# Altium schematic sheet schema_Project.SchDoc
size A4
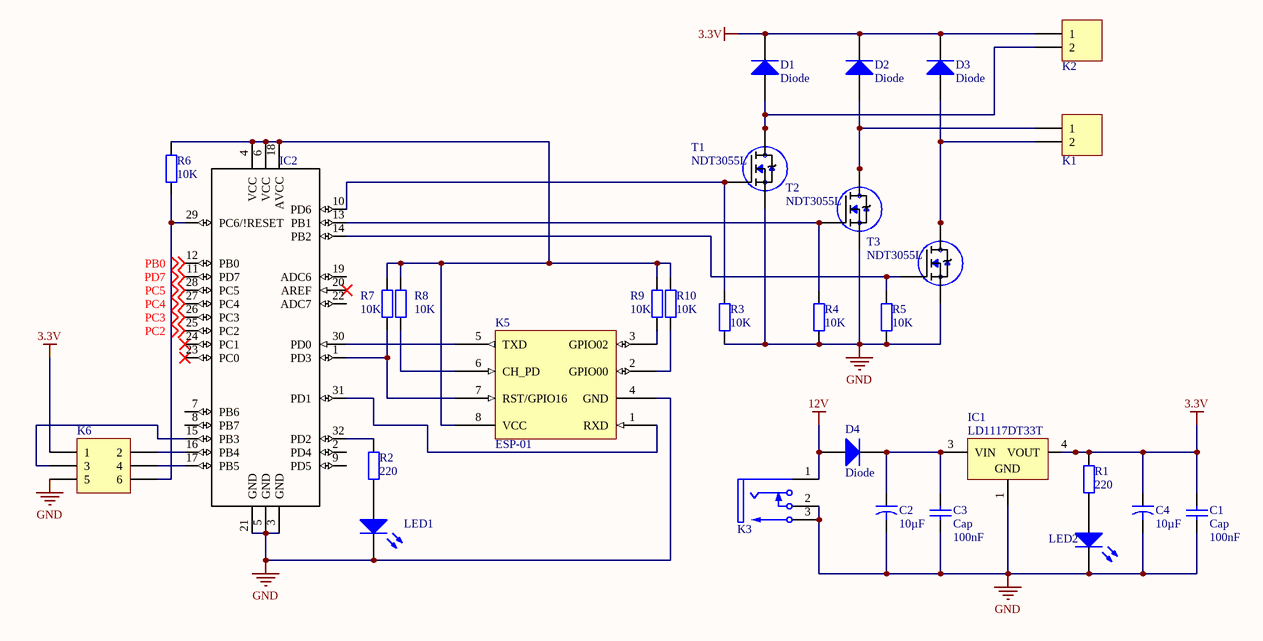
[diagram p0: schema_Project.SchDoc]

## Parts
C1  Cap  value 100nF  [C13+R]
C2  value 10µF  [C24]  (hidden comment: Cap2)
C3  Cap  value 100nF  [C13+R]
C4  value 10µF  [C24]  (hidden comment: Cap2)
D1  Diode  [Diode]
D2  Diode  [Diode]
D3  Diode  [Diode]
D4  Diode  [Diode]
ESP-01  K5  [HDR2X4]
IC1  LD1117DT33T  [TO-252_N]
IC2  ATMEGA328P-AU  [*QFP80P900X900X120-32N]  (value not drawn)
K1  K1  [K12]
K2  K2  [K12]
K3  K3  [SWITCH-RAPC712X-3_V]
K6  Header 3X2  [HDR2X3]  (value not drawn)
LED1  LED1  [LED]  (value not drawn)
LED2  LED2  [LED]  (value not drawn)
R1  value 220  [C13+R]  (hidden comment: Res2)
R2  value 220  [C13+R]  (hidden comment: Res2)
R3  value 10K  [C13+R]  (hidden comment: Res2)
R4  value 10K  [C13+R]  (hidden comment: Res2)
R5  value 10K  [C13+R]  (hidden comment: Res2)
R6  value 10K  [C13+R]  (hidden comment: Res2)
R7  value 10K  [C13+R]  (hidden comment: Res2)
R8  value 10K  [C13+R]  (hidden comment: Res2)
R9  value 10K  [C13+R]  (hidden comment: Res2)
R10  value 10K  [C13+R]  (hidden comment: Res2)
T1  NDT3055L  [*SOT223-4]
T2  NDT3055L  [*SOT223-4]
T3  NDT3055L  [*SOT223-4]

## Nets
3.3V: C1.2 C4.1 D1.K D2.K D3.K IC1.4(VOUT) K2.1 K6.1 R1.2
12V: D4.A K3.1
GND: C1.1 C2.2 C3.1 C4.2 ESP-01.4(GND) IC1.1(GND) IC2.3(GND) IC2.5(GND) IC2.21(GND) K3.2 K3.3 K6.5 LED1.K LED2.K R3.2 R4.1 R5.1 T1.3(S) T2.3(S) T3.3(S)
PB0: IC2.12(PB0) ; off-sheet PB0
PC2: IC2.25(PC2) ; off-sheet PC2
PC3: IC2.26(PC3) ; off-sheet PC3
PC4: IC2.27(PC4) ; off-sheet PC4
PC5: IC2.28(PC5) ; off-sheet PC5
PD7: IC2.11(PD7) ; off-sheet PD7
NetC2_1: C2.1 C3.2 D4.K IC1.3(VIN)
NetD1_A: D1.A K2.2 T1.2(D) T1.4(D)
NetD2_A: D2.A K1.1 T2.2(D) T2.4(D)
NetD3_A: D3.A K1.2 T3.2(D) T3.4(D)
NetESP-01_1: ESP-01.1(RXD) IC2.31(PD1)
NetESP-01_2: ESP-01.2(GPIO00) R10.1
NetESP-01_3: ESP-01.3(GPIO02) R9.1
NetESP-01_5: ESP-01.5(TXD) IC2.30(PD0)
NetESP-01_6: ESP-01.6(CH_PD) R8.1
NetESP-01_7: ESP-01.7(RST/GPIO16) IC2.1(PD3) R7.2
NetESP-01_8: ESP-01.8(VCC) IC2.4(VCC) IC2.6(VCC) IC2.18(AVCC) R6.2 R7.1 R8.2 R9.2 R10.2
NetIC2_10: IC2.10(PD6) R3.1 T1.1(G)
NetIC2_13: IC2.13(PB1) R4.2 T2.1(G)
NetIC2_14: IC2.14(PB2) R5.2 T3.1(G)
NetIC2_15: IC2.15(PB3) K6.3
NetIC2_16: IC2.16(PB4) K6.2
NetIC2_17: IC2.17(PB5) K6.4
NetIC2_29: IC2.29(PC6/!RESET) K6.6 R6.1
NetIC2_32: IC2.32(PD2) R2.2
NetLED1_A: LED1.A R2.1
NetLED2_A: LED2.A R1.1

Not connected (* = marked no-connect by the designer): IC2 2(PD4) 7(PB6) 8(PB7) 9(PD5) 19(ADC6) 20(AREF)* 22(ADC7) 23(PC0)* 24(PC1)*

## Library data of the parts
C1 C3 = Cap: Capacitor; Published: 8-Jun-2000; LatestRevisionDate: 17-Jul-2002; LatestRevisionNote: Re-released for DXP Platform.; PackageReference: RAD-0.3; Publisher: Altium Limited; PackageDescription: Radial Cap, Thru-Hole; 2 Leads; 0.3 in Pin Spacing
C2 C4 = Cap2: Capacitor; Published: 23-Sep-2002; PackageReference: CAPR5-4X5; Publisher: Altium Limited; PackageDescription: Capacitor; 2 Leads
D1-D4 = Diode: Default Diode; Published: 8-Jun-2000; LatestRevisionDate: 17-Jul-2002; LatestRevisionNote: Re-released for DXP Platform.; PackageVersion: Sep-1996; PackageReference: SMC; Publisher: Altium Limited; PackageDescription: DO-214-AB/SMC; 2 C-Bend Leads; Body 7.9 x 5.9 mm, inc. leads (LxW); Code_JEDEC: DO-214-AB
IC1 = CMP-0244-00088-1: Fixed Low Drop Positive Voltage Regulator, 3.3V, 3-Pin DPAK, Tape and Reel; ComponentLink1Description: Manufacturer URL; PackageVersion: 2011; PackageReference: TO-252; ComponentLink2Description: Datasheet; ComponentLink1URL: http://www.st.com; DatasheetVersion: 1/11/2011; PackageDescription: 3-Pin Transistor Outline Package 2.28 mm Pitch, 9.7 mm Lead Span (DPAK); ComponentLink2URL: http://www.st.com/internet/com/TECHNICAL_RESOURCES/TECHNICAL_LITERATURE/DATASHEET/CD00000544.pdf
IC2 = Component_1
K1 K2 = Header 2: Header, 2-Pin; LatestRevisionDate: 17-Jul-2002; LatestRevisionNote: Re-released for DXP Platform.; Publisher: Altium Limited
K3 = CMP-2000-05384-1: Power Jack, 5 A, 3-Pin THD, RoHS, Bulk; Manufacturer: Switchcraft; Current Rating: 5A; Plug/Mating Plug Diameter: 2.1mmID,5.5mmOD; Gender: Male; Mating Products: S765-ND / -CONNPLUGMINIPWR2CONDWHT/RED / S760K-ND / -CONNPOWERPLUGMINI.08"BLACK / SC1052-ND / -CONNPOWERPLUGMINIBLACK; Number of Positions/Contacts: 2Conductors,2Contacts; Internal Switch(s): SingleSwitch,NormallyClosed; Shielding: Unshielded; Catalog Drawings: RAPC7(1,2)2XSide / RAPC7(1,2)2XTop; Dynamic Catalog: SwitchcraftInc; Other Names: Q2287470A / RAPC722X-ND / SC1313; Standard Package: 2,500; Termination: SolderEyelet(s); Family: Barrel-PowerConnectors; Housing Color: Black; Housing Material: Thermoplastic; RoHS Information: SwitchcraftRoHSInfo; Color: Black; Contact Material - Plating: Nickel; Mounting Type: ThroughHole,RightAngle; Manufacturer URL: http://www.switchcraft.com/; Contact Material: Brass; Datasheet Version: Rev. A, 08/2005; Connector Type: Jack; Category: Connectors,Interconnects; Datasheet URL: http://www.mouser.com/ds/2/393/rapc722x_cd-371352.pdf
K6 = Header 3X2: Header, 3-Pin, Dual row; LatestRevisionDate: 17-Jul-2002; LatestRevisionNote: Re-released for DXP Platform.; Publisher: Altium Limited
LED1 = LED1: Typical RED GaAs LED; Published: 8-Jun-2000; LatestRevisionDate: 08-Jul-2005; LatestRevisionNote: Mech Layer 1 removed.; PackageReference: LED-1; Publisher: Altium Limited; PackageDescription: LED; 2 Leads
LED2 = LED2: Typical RED, GREEN, YELLOW, AMBER GaAs LED; Published: 8-Jun-2000; LatestRevisionDate: 17-Jul-2002; LatestRevisionNote: Re-released for DXP Platform.; PackageVersion: Feb-2002; PackageReference: 3.2X1.6X1.1; Publisher: Altium Limited; PackageDescription: SM LED; 2 Flat Leads
R1-R10 = Res2: Resistor; Published: 8-Jun-2000; LatestRevisionDate: 17-Jul-2002; LatestRevisionNote: Re-released for DXP Platform.; PackageReference: AXIAL-0.4; Publisher: Altium Limited; PackageDescription: Axial Device, Thru-Hole; 2 Leads; 0.4 in Pin Spacing
T1-T3 = NDT3055L: SnapEDA_Link: https://www.snapeda.com/parts/NDT3055L/ON%20Semiconductor/view-part/2773473/?ref=snap; Value: *